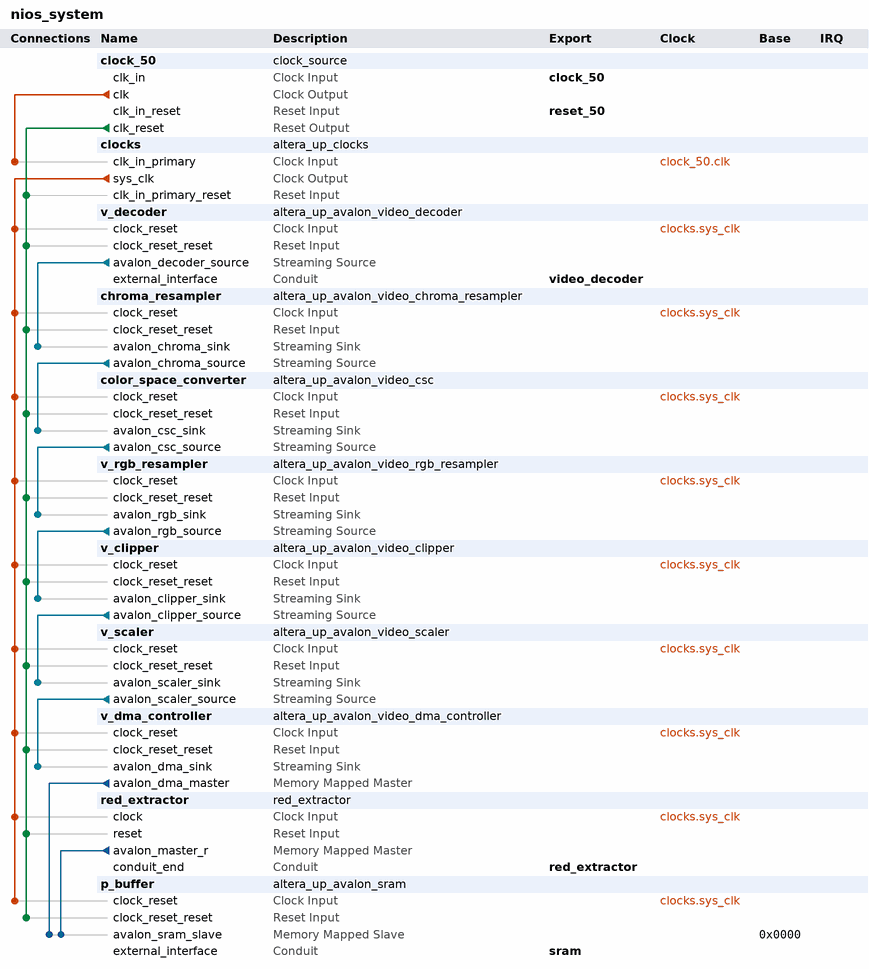
[diagram p0: system contents]
# Platform Designer (Qsys) system nios_system, Cyclone II EP2C35F672C6
# Parameters at their usual value, and those the tool derives, are not listed.
package require -exact qsys 13.0
create_system nios_system
set_project_property DEVICE_FAMILY {Cyclone II}
set_project_property DEVICE EP2C35F672C6

add_instance clock_50 clock_source 13.0
set_instance_parameter_value clock_50 clockFrequency 50000000

add_instance clocks altera_up_clocks 13.0
set_instance_parameter_value clocks board DE2
set_instance_parameter_value clocks sdram_clk false
set_instance_parameter_value clocks vga_clk true
set_instance_parameter_value clocks audio_clk false
set_instance_parameter_value clocks audio_clk_freq 12.288

add_instance v_decoder altera_up_avalon_video_decoder 13.0

add_instance chroma_resampler altera_up_avalon_video_chroma_resampler 13.0

add_instance color_space_converter altera_up_avalon_video_csc 13.0

add_instance v_rgb_resampler altera_up_avalon_video_rgb_resampler 13.0
set_instance_parameter_value v_rgb_resampler input_type {24-bit RGB}
set_instance_parameter_value v_rgb_resampler output_type {16-bit RGB}
set_instance_parameter_value v_rgb_resampler alpha 1023

add_instance v_clipper altera_up_avalon_video_clipper 13.0
set_instance_parameter_value v_clipper color_bits 16
set_instance_parameter_value v_clipper color_planes 1

add_instance v_scaler altera_up_avalon_video_scaler 13.0
set_instance_parameter_value v_scaler width_scaling 0.5
set_instance_parameter_value v_scaler height_scaling 1
set_instance_parameter_value v_scaler width_in 640
set_instance_parameter_value v_scaler color_bits 16
set_instance_parameter_value v_scaler color_planes 1

add_instance v_dma_controller altera_up_avalon_video_dma_controller 13.0
set_instance_parameter_value v_dma_controller mode {From Stream to Memory}
set_instance_parameter_value v_dma_controller addr_mode Consecutive
set_instance_parameter_value v_dma_controller start_address 0
set_instance_parameter_value v_dma_controller back_start_address 0
set_instance_parameter_value v_dma_controller width 320
set_instance_parameter_value v_dma_controller height 240
set_instance_parameter_value v_dma_controller color_bits 16
set_instance_parameter_value v_dma_controller color_planes 1
set_instance_parameter_value v_dma_controller dma_enabled true

add_instance red_extractor red_extractor 1.0
set_instance_parameter_value red_extractor pixel_buffer_base 0

add_instance p_buffer altera_up_avalon_sram 13.0
set_instance_parameter_value p_buffer board DE2
set_instance_parameter_value p_buffer pixel_buffer true

# connections
add_connection clock_50.clk clocks.clk_in_primary clock
add_connection clocks.sys_clk chroma_resampler.clock_reset clock
add_connection clocks.sys_clk color_space_converter.clock_reset clock
add_connection clocks.sys_clk p_buffer.clock_reset clock
add_connection clocks.sys_clk red_extractor.clock clock
add_connection clocks.sys_clk v_clipper.clock_reset clock
add_connection clocks.sys_clk v_decoder.clock_reset clock
add_connection clocks.sys_clk v_dma_controller.clock_reset clock
add_connection clocks.sys_clk v_rgb_resampler.clock_reset clock
add_connection clocks.sys_clk v_scaler.clock_reset clock
add_connection clock_50.clk_reset chroma_resampler.clock_reset_reset reset
add_connection clock_50.clk_reset clocks.clk_in_primary_reset reset
add_connection clock_50.clk_reset color_space_converter.clock_reset_reset reset
add_connection clock_50.clk_reset p_buffer.clock_reset_reset reset
add_connection clock_50.clk_reset red_extractor.reset reset
add_connection clock_50.clk_reset v_clipper.clock_reset_reset reset
add_connection clock_50.clk_reset v_decoder.clock_reset_reset reset
add_connection clock_50.clk_reset v_dma_controller.clock_reset_reset reset
add_connection clock_50.clk_reset v_rgb_resampler.clock_reset_reset reset
add_connection clock_50.clk_reset v_scaler.clock_reset_reset reset
add_connection red_extractor.avalon_master_r p_buffer.avalon_sram_slave avalon
set_connection_parameter_value red_extractor.avalon_master_r/p_buffer.avalon_sram_slave baseAddress 0x0000
add_connection v_dma_controller.avalon_dma_master p_buffer.avalon_sram_slave avalon
set_connection_parameter_value v_dma_controller.avalon_dma_master/p_buffer.avalon_sram_slave baseAddress 0x0000
add_connection chroma_resampler.avalon_chroma_source color_space_converter.avalon_csc_sink avalon_streaming
add_connection color_space_converter.avalon_csc_source v_rgb_resampler.avalon_rgb_sink avalon_streaming
add_connection v_clipper.avalon_clipper_source v_scaler.avalon_scaler_sink avalon_streaming
add_connection v_decoder.avalon_decoder_source chroma_resampler.avalon_chroma_sink avalon_streaming
add_connection v_rgb_resampler.avalon_rgb_source v_clipper.avalon_clipper_sink avalon_streaming
add_connection v_scaler.avalon_scaler_source v_dma_controller.avalon_dma_sink avalon_streaming

# exported interfaces
add_interface clock_50 clock sink
set_interface_property clock_50 EXPORT_OF clock_50.clk_in
add_interface reset_50 reset sink
set_interface_property reset_50 EXPORT_OF clock_50.clk_in_reset
add_interface video_decoder conduit end
set_interface_property video_decoder EXPORT_OF v_decoder.external_interface
add_interface sram conduit end
set_interface_property sram EXPORT_OF p_buffer.external_interface
add_interface red_extractor conduit end
set_interface_property red_extractor EXPORT_OF red_extractor.conduit_end

set_interconnect_requirement {$system} qsys_mm.clockCrossingAdapter HANDSHAKE
set_interconnect_requirement {$system} qsys_mm.maxAdditionalLatency 1

save_system nios_system.qsys
